# Altium schematic sheet Remotor.SchDoc
size A4
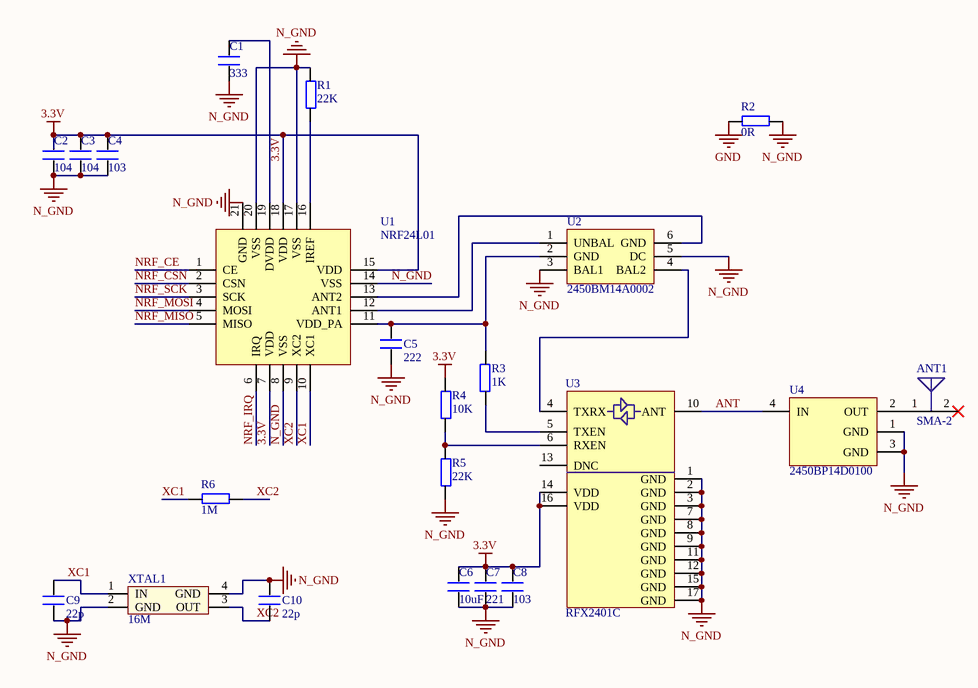
[diagram p0: Remotor.SchDoc]

## Parts
ANT1  SMA-2  [SMB]
C1  333  [0402]
C2  104  [0402]
C3  104  [0402]
C4  103  [0402]
C5  222  [0402]
C6  10uF  [0805]
C7  221  [0402]
C8  103  [0402]
C9  22p  [0402]
C10  22p  [0402]
R1  22K  [0402]
R2  0R  [0402]
R3  1K  [0402]
R4  10K  [0402]
R5  22K  [0402]
R6  1M  [0402]
U1  NRF24L01  [QFN20]
U2  2450BM14A0002  [0603-6]
U3  RFX2401C  [QFN16M]
U4  2450BP14D0100  [BALUN_250BP]
XTAL1  16M  [XTAL3225   无源]

## Nets
3.3V: C2.2 C3.2 C4.2 C6.1 C7.1 C8.1 R4.2 U1.7(VDD) U1.15(VDD) U1.18(VDD) U3.14(VDD) U3.16(VDD)
GND: R2.2
N_GND: C1.1 C2.1 C3.1 C4.1 C5.2 C6.2 C7.2 C8.2 C9.2 C10.1 R1.2 R2.1 R5.1 U1.8(VSS) U1.14(VSS) U1.17(VSS) U1.20(VSS) U1.21(GND) U2.3(BAL1) U2.5(DC) U3.1(GND) U3.2(GND) U3.3(GND) U3.7(GND) U3.8(GND) U3.9(GND) U3.11(GND) U3.12(GND) U3.15(GND) U3.17(GND) U4.1(GND) U4.3(GND) XTAL1.2(GND) XTAL1.4(GND)
ANT: U3.10(ANT) U4.4(IN)
NRF_CE: U1.1(CE)
NRF_CSN: U1.2(CSN)
NRF_IRQ: U1.6(IRQ)
NRF_MISO: U1.5(MISO)
NRF_MOSI: U1.4(MOSI)
NRF_SCK: U1.3(SCK)
XC1: C9.1 R6.2 U1.10(XC1) XTAL1.1(IN)
XC2: C10.2 R6.1 U1.9(XC2) XTAL1.3(OUT)
NetANT1_1: ANT1.1(FP) U4.2(OUT)
NetC1_2: C1.2 U1.19(DVDD)
NetC5_1: C5.1 R3.1 U1.11(VDD_PA) U2.2(GND)
NetR1_1: R1.1 U1.16(IREF)
NetR3_2: R3.2 U3.5(TXEN)
NetR4_1: R4.1 R5.2 U3.6(RXEN)
NetU1_12: U1.12(ANT1) U2.1(UNBAL)
NetU1_13: U1.13(ANT2) U2.6(GND)
NetU2_4: U2.4(BAL2) U3.4(TXRX)

Not connected (* = marked no-connect by the designer): ANT1 2(NC)*; U3 13(DNC)

## Library data of the parts
ANT1 = CHIP_ANTENNA
C1-C10 = C
R1-R6 = R
U1 = nrf24xx
U2 = BALUN
U4 = BALUN_1
XTAL1 = XTAL-无源贴片: 无源贴片晶振